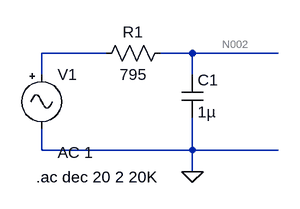
[diagram p0: schematic Task 1.asc]
Task 1.asc, the LTspice schematic file:
Version 4
SHEET 1 880 680
WIRE 128 96 32 96
WIRE 256 96 208 96
WIRE 384 96 256 96
WIRE 32 128 32 96
WIRE 256 128 256 96
WIRE 32 240 32 208
WIRE 256 240 256 192
WIRE 256 240 32 240
WIRE 384 240 256 240
WIRE 256 272 256 240
FLAG 256 272 0
SYMBOL cap 240 128 R0
SYMATTR InstName C1
SYMATTR Value 1µ
SYMBOL res 224 80 R90
WINDOW 0 0 56 VBottom 2
WINDOW 3 32 56 VTop 2
SYMATTR InstName R1
SYMATTR Value 795
SYMBOL Misc\\signal 32 112 R0
WINDOW 123 24 132 Left 2
WINDOW 39 0 0 Left 0
SYMATTR InstName V1
SYMATTR Value ""
SYMATTR Value2 AC 1
TEXT 24 280 Left 2 !.ac dec 20 2 20K

The netlist it stands for:
* Task 1.asc
C1 N002 0 1µ
R1 N002 N001 795
V1 N001 0 AC 1
.ac dec 20 2 20K
.backanno
.end

* Results of the author's LTspice run, read from the files saved beside the schematic
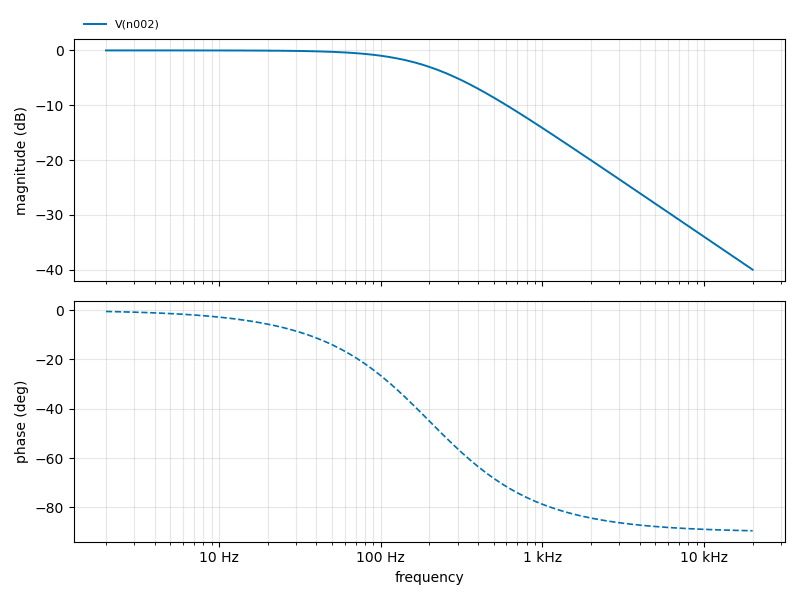
[diagram p1: AC Analysis of Task 1.asc, plotted from the saved traces]
* AC Analysis, 1 run:
*   V(n002): -0.00 dB at 2 Hz, -39.99 dB at 20 kHz, peak -0.00 dB at 2 Hz, 3 dB below the peak at 200.2 Hz